# Altium project EnviroSense.PrjPcb (part 1 of 2)
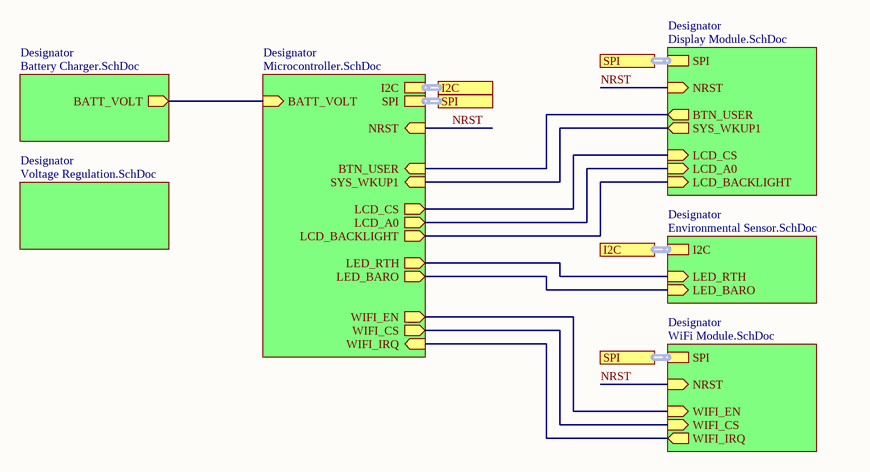
[diagram p0: EnviroSense.SchDoc]
7 sheets, 93 parts. Net scope: hierarchical (ports join the sheet entries above them; power ports are global).
Board file: EnviroSense.PcbDoc
Sheets:
  EnviroSense.SchDoc
    Designator = Microcontroller.SchDoc
    Designator = Battery Charger.SchDoc
    Designator = Voltage Regulation.SchDoc
    Designator = WiFi Module.SchDoc
    Designator = Environmental Sensor.SchDoc
    Designator = Display Module.SchDoc

## Sheet EnviroSense.SchDoc: EnviroSense Weather Monitor
size A4; SheetNumber: 1; SheetTotal: 7

### Sub-sheets
Designator = Microcontroller.SchDoc: LCD_CS (out), BATT_VOLT (in), NRST (in), LCD_A0 (out), WIFI_EN (out), LED_BARO (out), LCD_BACKLIGHT (out), WIFI_IRQ (in), SYS_WKUP1 (in), I2C (harness I2C), BTN_USER (in), WIFI_CS (out), SPI (harness SPI), LED_RTH (out)
Designator = Battery Charger.SchDoc: BATT_VOLT (out)
Designator = Voltage Regulation.SchDoc: no entries
Designator = WiFi Module.SchDoc: WIFI_EN (in), WIFI_IRQ (out), NRST (in), SPI (harness SPI), WIFI_CS (in)
Designator = Environmental Sensor.SchDoc: LED_BARO (in), I2C (harness I2C), LED_RTH (in)
Designator = Display Module.SchDoc: LCD_A0 (in), SPI (harness SPI), NRST (in), BTN_USER (out), SYS_WKUP1 (out), LCD_CS (in), LCD_BACKLIGHT (in)

### Ports
I2C (harness I2C), SPI (harness SPI)

### Nets
BATT_VOLT: sheet Designator/BATT_VOLT, sheet Designator/BATT_VOLT
BTN_USER: sheet Designator/BTN_USER, sheet Designator/BTN_USER
LCD_A0: sheet Designator/LCD_A0, sheet Designator/LCD_A0
LCD_BACKLIGHT: sheet Designator/LCD_BACKLIGHT, sheet Designator/LCD_BACKLIGHT
LCD_CS: sheet Designator/LCD_CS, sheet Designator/LCD_CS
LED_BARO: sheet Designator/LED_BARO, sheet Designator/LED_BARO
LED_RTH: sheet Designator/LED_RTH, sheet Designator/LED_RTH
NRST: sheet Designator/NRST, sheet Designator/NRST, sheet Designator/NRST
SYS_WKUP1: sheet Designator/SYS_WKUP1, sheet Designator/SYS_WKUP1
WIFI_CS: sheet Designator/WIFI_CS, sheet Designator/WIFI_CS
WIFI_EN: sheet Designator/WIFI_EN, sheet Designator/WIFI_EN
WIFI_IRQ: sheet Designator/WIFI_IRQ, sheet Designator/WIFI_IRQ

### Buses and harness runs
harness port I2C = sheet Designator/I2C
harness port SPI = sheet Designator/SPI

### Notes on the sheet
- Title
- Size:
- Date:
- A4
- Number:
- Time:
- Revision:
- Sheet
- of
- File:

## Sheet Microcontroller.SchDoc: Microcontroller
size A4; SheetNumber: 4; SheetTotal: 7
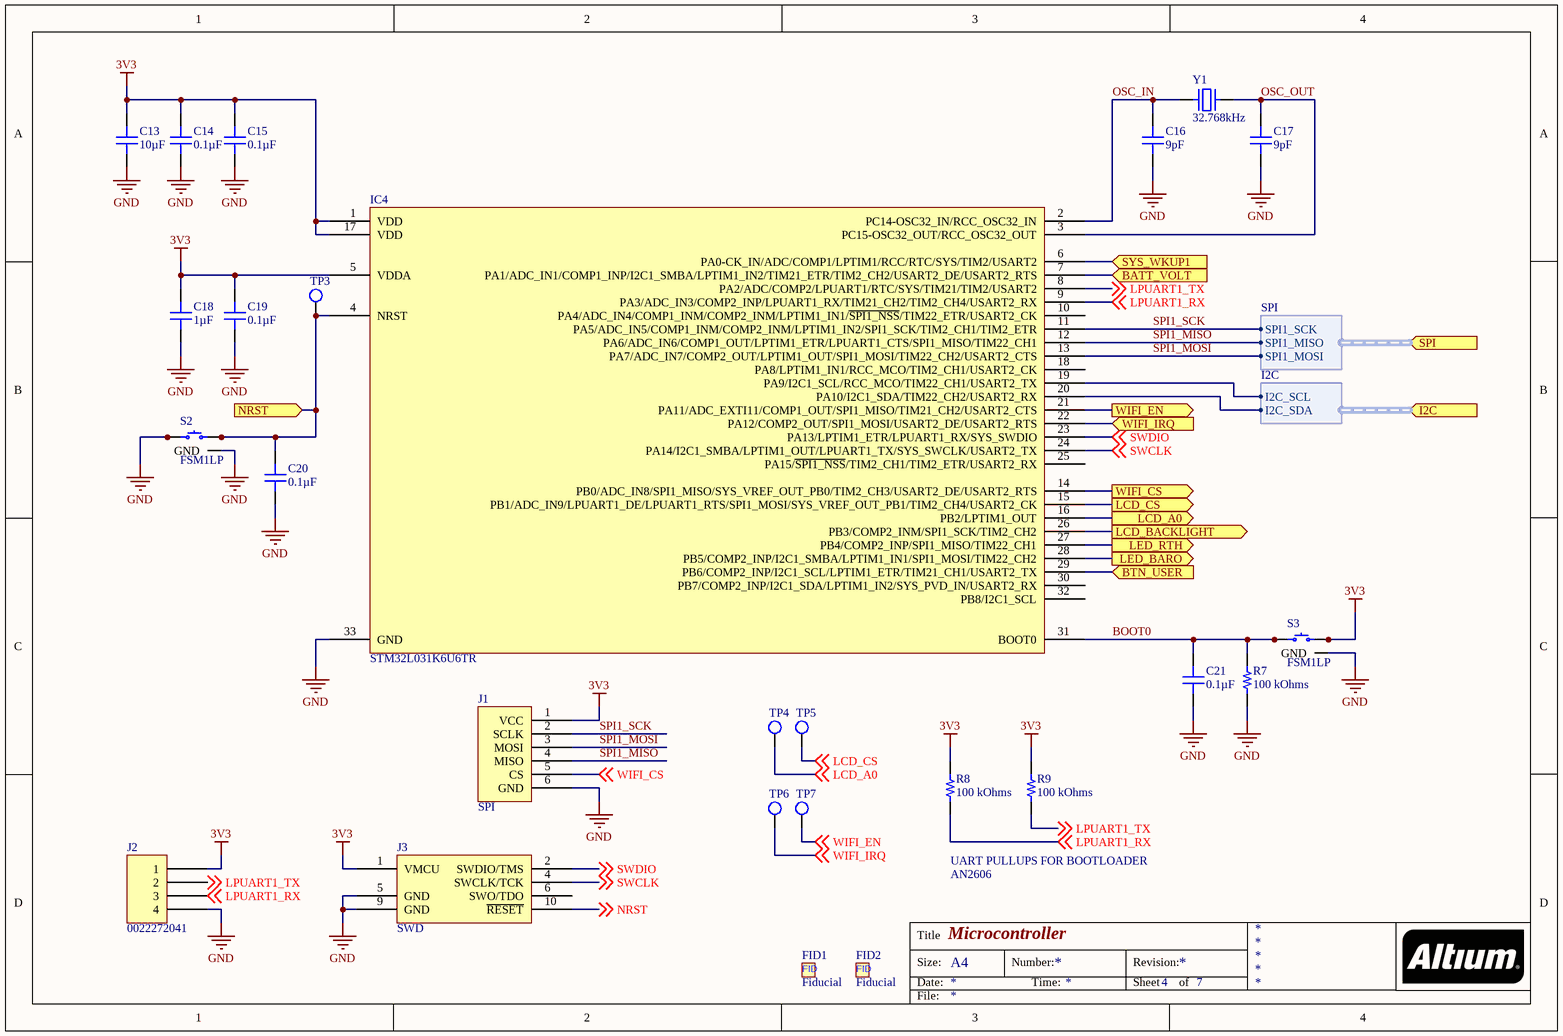
[diagram p1: Microcontroller.SchDoc]

### Parts
C13  10µF  [CAP 0805_2012]
C14  0.1µF  [CAP 0603_1608]
C15  0.1µF  [CAP 0603_1608]
C16  9pF  [CAP 0603_1608]
C17  9pF  [CAP 0603_1608]
C18  1µF  [CAP 0603_1608]
C19  0.1µF  [CAP 0603_1608]
C20  0.1µF  [CAP 0603_1608]
C21  0.1µF  [CAP 0603_1608]
FID1  Fiducial  [Fiducial-1mm]
FID2  Fiducial  [Fiducial-1mm]
IC4  STM32L031K6U6TR  [ST UFQFPN32 5x5MM]
J1  SPI  [SPI Breakout]
J2  0022272041  [MOLEX KK 0022272041]
J3  SWD  [10 Pin SWD]  (no BOM)
R7  100 kOhms  [RES 0603_1608]
R8  100 kOhms  [RES 0603_1608]
R9  100 kOhms  [RES 0603_1608]
S2  FSM1LP  [TE FSM1LPATR]
S3  FSM1LP  [TE FSM1LPATR]
TP3  Test Point  [TestPoint-1.5mm]  (value not drawn)  (no BOM)
TP4  Test Point  [TestPoint-1.5mm]  (value not drawn)  (no BOM)
TP5  Test Point  [TestPoint-1.5mm]  (value not drawn)  (no BOM)
TP6  Test Point  [TestPoint-1.5mm]  (value not drawn)  (no BOM)
TP7  Test Point  [TestPoint-1.5mm]  (value not drawn)  (no BOM)
Y1  32.768kHz  [ABRACON ABS07]

### Ports
BATT_VOLT (in), BTN_USER (in), I2C (in, harness I2C), LCD_A0 (out), LCD_BACKLIGHT (out), LCD_CS (out), LED_BARO (out), LED_RTH (out), NRST (in), SPI (in, harness SPI), SYS_WKUP1 (in), WIFI_CS (out), WIFI_EN (out), WIFI_IRQ (in)

### Harnesses
SPI: SPI1_MISO, SPI1_MOSI, SPI1_SCK
I2C: I2C_SDA, I2C_SCL

### Nets
3V3: C13.2 C14.2 C15.2 C18.2 C19.2 IC4.1(VDD) IC4.5(VDDA) IC4.17(VDD) J1.1(VCC) J2.1 J3.1(VMCU) R8.2 R9.2 S3.3 S3.4
GND: C13.1 C14.1 C15.1 C16.1 C17.1 C18.1 C19.1 C20.1 C21.1 IC4.33(GND) J1.6(GND) J2.4 J3.5(GND) J3.9(GND) R7.1 S2.1 S2.2 S2.5(GND) S3.5(GND)
BATT_VOLT: IC4.7(PA1/ADC_IN1/COMP1_INP/I2C1_SMBA/LPTIM1_IN2/TIM21_ETR/TIM2_CH2/USART2_DE/USART2_RTS) ; port BATT_VOLT
BOOT0: C21.2 IC4.31(BOOT0) R7.2 S3.1 S3.2
BTN_USER: IC4.29(PB6/COMP2_INP/I2C1_SCL/LPTIM1_ETR/TIM21_CH1/USART2_TX) ; port BTN_USER
I2C_SCL: IC4.19(PA9/I2C1_SCL/RCC_MCO/TIM22_CH1/USART2_TX) ; port I2C.I2C_SCL
I2C_SDA: IC4.20(PA10/I2C1_SDA/TIM22_CH2/USART2_RX) ; port I2C.I2C_SDA
LCD_A0: IC4.16(PB2/LPTIM1_OUT) ; port LCD_A0
LCD_A0: TP4.1(TP) ; off-sheet LCD_A0  [a separate net that carries the same name]
LCD_BACKLIGHT: IC4.26(PB3/COMP2_INM/SPI1_SCK/TIM2_CH2) ; port LCD_BACKLIGHT
LCD_CS: IC4.15(PB1/ADC_IN9/LPUART1_DE/LPUART1_RTS/SPI1_MOSI/SYS_VREF_OUT_PB1/TIM2_CH4/USART2_CK) ; port LCD_CS
LCD_CS: TP5.1(TP) ; off-sheet LCD_CS  [a separate net that carries the same name]
LED_BARO: IC4.28(PB5/COMP2_INP/I2C1_SMBA/LPTIM1_IN1/SPI1_MOSI/TIM22_CH2) ; port LED_BARO
LED_RTH: IC4.27(PB4/COMP2_INP/SPI1_MISO/TIM22_CH1) ; port LED_RTH
LPUART1_RX: IC4.9(PA3/ADC_IN3/COMP2_INP/LPUART1_RX/TIM21_CH2/TIM2_CH4/USART2_RX) J2.3 R8.1 ; off-sheet LPUART1_RX
LPUART1_TX: IC4.8(PA2/ADC/COMP2/LPUART1/RTC/SYS/TIM21/TIM2/USART2) J2.2 R9.1 ; off-sheet LPUART1_TX
NRST: C20.2 IC4.4(NRST) S2.3 S2.4 TP3.1(TP) ; port NRST
NRST: J3.10(~{RESET}) ; off-sheet NRST  [a separate net that carries the same name]
OSC_IN: C16.2 IC4.2(PC14-OSC32_IN/RCC_OSC32_IN) Y1.1
OSC_OUT: C17.2 IC4.3(PC15-OSC32_OUT/RCC_OSC32_OUT) Y1.2
SPI1_MISO: IC4.12(PA6/ADC_IN6/COMP1_OUT/LPTIM1_ETR/LPUART1_CTS/SPI1_MISO/TIM22_CH1) J1.4(MISO) ; port SPI.SPI1_MISO
SPI1_MOSI: IC4.13(PA7/ADC_IN7/COMP2_OUT/LPTIM1_OUT/SPI1_MOSI/TIM22_CH2/USART2_CTS) J1.3(MOSI) ; port SPI.SPI1_MOSI
SPI1_SCK: IC4.11(PA5/ADC_IN5/COMP1_INM/COMP2_INM/LPTIM1_IN2/SPI1_SCK/TIM2_CH1/TIM2_ETR) J1.2(SCLK) ; port SPI.SPI1_SCK
SWCLK: IC4.24(PA14/I2C1_SMBA/LPTIM1_OUT/LPUART1_TX/SYS_SWCLK/USART2_TX) J3.4(SWCLK/TCK) ; off-sheet SWCLK
SWDIO: IC4.23(PA13/LPTIM1_ETR/LPUART1_RX/SYS_SWDIO) J3.2(SWDIO/TMS) ; off-sheet SWDIO
SYS_WKUP1: IC4.6(PA0-CK_IN/ADC/COMP1/LPTIM1/RCC/RTC/SYS/TIM2/USART2) ; port SYS_WKUP1
WIFI_CS: IC4.14(PB0/ADC_IN8/SPI1_MISO/SYS_VREF_OUT_PB0/TIM2_CH3/USART2_DE/USART2_RTS) ; port WIFI_CS
WIFI_CS: J1.5(CS) ; off-sheet WIFI_CS  [a separate net that carries the same name]
WIFI_EN: IC4.21(PA11/ADC_EXTI11/COMP1_OUT/SPI1_MISO/TIM21_CH2/USART2_CTS) ; port WIFI_EN
WIFI_EN: TP7.1(TP) ; off-sheet WIFI_EN  [a separate net that carries the same name]
WIFI_IRQ: IC4.22(PA12/COMP2_OUT/SPI1_MOSI/USART2_DE/USART2_RTS) ; port WIFI_IRQ
WIFI_IRQ: TP6.1(TP) ; off-sheet WIFI_IRQ  [a separate net that carries the same name]

Not connected (* = marked no-connect by the designer): IC4 10(PA4/ADC_IN4/COMP1_INM/COMP2_INM/LPTIM1_IN1/~{SPI1_NSS}/TIM22_ETR/USART2_CK) 18(PA8/LPTIM1_IN1/RCC_MCO/TIM2_CH1/USART2_CK) 25(PA15/~{SPI1_NSS}/TIM2_CH1/TIM2_ETR/USART2_RX) 30(PB7/COMP2_INP/I2C1_SDA/LPTIM1_IN2/SYS_PVD_IN/USART2_RX) 32(PB8/I2C1_SCL); J3 6(SWO/TDO)

### Notes on the sheet
- UART PULLUPS FOR BOOTLOADER
- AN2606
- Title
- Size:
- Date:
- A4
- Number:
- Time:
- Revision:
- Sheet
- of
- File:
- (in symbol Fiducial) FID

### Library data of the parts
C13 = CL21A106KPCLQNC: CAP CER 10UF 10V X5R 0805; Manufacturer: Samsung Electro-Mechanics; Tolerance: ±10%; Part Number: CL21A106KPCLQNC; Value: 10µF; Applications: General Purpose; Capacitance: 10µF; ComponentLink1Description: Datasheet; ComponentLink1URL: http://www.samsungsem.com/kr/support/product-search/mlcc/CL21A106KPCLQNC.jsp; ComponentLink2Description: DigiKey Link; ComponentLink2URL: http://digikey.com/product-detail/en/samsung-electro-mechanics/CL21A106KPCLQNC/1276-2402-1-ND/3890488; Device Package: 0805 (2012 Metric); LastUpdated: 02/09/2020 01:04:19; Lifecycle Status: Active; Minimum Order: 1; Mounting Type: Surface Mount, MLCC; Operating Temperature: -55°C ~ 85°C; Package / Case: 0805 (2012 Metric); Packaging: TapeAndReel; PartId: 14319; Part Status: Active; Price: 0.03; Series: CL; Size / Dimension: 0.079" L x 0.049" W (2.00mm x 1.25mm); Supplier 1: DigiKey; Supplier Part Number 1: 1276-2402-1-ND; Temperature Coefficient: X5R; Thickness (Max): 0.037" (0.95mm); Voltage - Rated: 10V
C14 C15 C19-C21 = 06035C104JAT4A: CAP CER 0.1UF 50V X7R 0603; Manufacturer: AVX Corporation; Tolerance: ±5%; Part Number: 06035C104JAT4A; Value: 0.1µF; Applications: General Purpose; Capacitance: 0.1µF; ComponentLink1Description: Datasheet; ComponentLink1URL: http://datasheets.avx.com/X7RDielectric.pdf; ComponentLink2Description: DigiKey Link; ComponentLink2URL: http://digikey.com/product-detail/en/avx-corporation/06035C104JAT4A/478-12459-1-ND/9749311; Device Package: 0603 (1608 Metric); LastUpdated: 02/09/2020 01:03:34; Lifecycle Status: Active; Minimum Order: 1; Mounting Type: Surface Mount, MLCC; Operating Temperature: -55°C ~ 125°C; Package / Case: 0603 (1608 Metric); Packaging: TapeAndReel; PartId: 3002; Part Status: Active; Price: 0.01; Series: -; Size / Dimension: 0.063" L x 0.032" W (1.60mm x 0.81mm); Supplier 1: DigiKey; Supplier Part Number 1: 478-12459-1-ND; Temperature Coefficient: X7R; Thickness (Max): 0.035" (0.90mm); Voltage - Rated: 50V
C16 C17 = CL10C090CB8NNNC: CAP CER 9PF 50V C0G/NP0 0603; Manufacturer: Samsung Electro-Mechanics; Temperature Coefficient: C0G, NP0; Tolerance: ±0.25pF; Part Number: CL10C090CB8NNNC; Value: 9pF; Applications: General Purpose; Capacitance: 9pF; ComponentLink1Description: Datasheet; ComponentLink1URL: http://www.samsungsem.com/kr/support/product-search/mlcc/CL10C090CB8NNNC.jsp; ComponentLink2Description: DigiKey Link; ComponentLink2URL: http://digikey.com/product-detail/en/samsung-electro-mechanics/CL10C090CB8NNNC/1276-2142-1-ND/3890228; Device Package: 0603 (1608 Metric); LastUpdated: 02/09/2020 01:03:13; Lifecycle Status: Active; Minimum Order: 1; Mounting Type: Surface Mount, MLCC; Operating Temperature: -55°C ~ 125°C; Package / Case: 0603 (1608 Metric); Packaging: TapeAndReel; PartId: 14182; Part Status: Active; Price: 0.01; Series: CL; Size / Dimension: 0.063" L x 0.031" W (1.60mm x 0.80mm); Supplier 1: DigiKey; Supplier Part Number 1: 1276-2142-1-ND; Thickness (Max): 0.035" (0.90mm); Voltage - Rated: 50V
C18 = LMK107B7105KA-T: CAP CER 1UF 10V X7R 0603; Manufacturer: Taiyo Yuden; Tolerance: ±10%; Part Number: LMK107B7105KA-T; Value: 1µF; Applications: General Purpose; Capacitance: 1µF; ComponentLink1Description: Datasheet; ComponentLink1URL: https://www.yuden.co.jp/productdata/catalog/mlcc01_e.pdf; ComponentLink2Description: DigiKey Link; ComponentLink2URL: http://digikey.com/product-detail/en/taiyo-yuden/LMK107B7105KA-T/587-1242-1-ND/931019; Device Package: 0603 (1608 Metric); LastUpdated: 02/09/2020 01:03:30; Lifecycle Status: Active; Minimum Order: 1; Mounting Type: Surface Mount, MLCC; Operating Temperature: -55°C ~ 125°C; Package / Case: 0603 (1608 Metric); Packaging: TapeAndReel; PartId: 5525; Part Status: Active; Price: 0.01; Series: M; Size / Dimension: 0.063" L x 0.031" W (1.60mm x 0.80mm); Supplier 1: DigiKey; Supplier Part Number 1: 587-1242-1-ND; Temperature Coefficient: X7R; Thickness (Max): 0.035" (0.90mm); Voltage - Rated: 10V
IC4 = STM32L031K6U6TR: IC MCU 32BIT 32KB FLASH 32UFQFPN; Manufacturer: STMicroelectronics; Connectivity: I²C, IrDA, LINbus, SPI, UART/USART; Core Processor: ARM® Cortex®-M0+; Core Size: 32-Bit; Data Converters: A/D 10x12b; EEPROM Size: 1K x 8; Number of I/O: 27; Oscillator Type: Internal; Peripherals: Brown-out Detect/Reset, DMA, POR, PWM, WDT; Program Memory Size: 32KB (32K x 8); RAM Size: 8K x 8; Speed: 32MHz; Voltage - Supply (Vcc/Vdd): 1.8V ~ 3.6V; Part Number: STM32L031K6U6TR; ComponentLink1Description: Datasheet; ComponentLink1URL: http://www.st.com/content/ccc/resource/technical/document/datasheet/aa/5d/77/ad/1a/59/4a/b9/DM00140359.pdf/files/DM00140359.pdf/jcr:content/translations/en.DM00140359.pdf; ComponentLink2Description: DigiKey Link; ComponentLink2URL: http://digikey.com/product-detail/en/stmicroelectronics/STM32L031K6U6TR/497-18807-1-ND/9958467; LastUpdated: 18/01/2022 11:56:57; Lifecycle Status: Active; Minimum Order: 1; Mounting Type: Surface Mount; Operating Temperature: -40°C ~ 85°C (TA); Package / Case: 32-UFQFN Exposed Pad; Packaging: TapeAndReel; PartId: 225; Part Status: Active; Price: 1.15; Program Memory Type: FLASH; Series: STM32L0; Supplier 1: DigiKey; Supplier Part Number 1: 497-18807-1-ND; Supplier Device Package: 32-UFQFPN (5x5)
J2 = 0022272041: CONN HEADER VERT 4POS 2.54MM; Manufacturer: Molex; Contact Length - Mating: 0.295" (7.49mm); Contact Length - Post: 0.140" (3.56mm); Material Flammability Rating: UL94 V-0; Number of Positions: 4; Number of Positions Loaded: All; Overall Contact Length: 0.560" (14.22mm); Pitch - Mating: 0.100" (2.54mm); Shrouding: Shrouded - 1 Wall; Style: Board to Cable/Wire; Part Number: 0022272041; ComponentLink1Description: Datasheet; ComponentLink1URL: https://www.molex.com/pdm_docs/sd/022272041_sd.pdf; ComponentLink2Description: DigiKey Link; ComponentLink2URL: http://digikey.com/product-detail/en/molex/0022272041/WM4113-ND/1130579; Connector Type: Header; Contact Finish - Mating: Tin; Contact Finish - Post: Tin; Contact Finish Thickness - Mating: 100.0µin (2.54µm); Contact Material: Brass; Contact Shape: Square; Contact Type: Male Pin; Fastening Type: Friction Lock; Insulation Color: Natural; Insulation Height: 0.461" (11.70mm); Insulation Material: Polyamide (PA), Nylon; LastUpdated: 12/01/2020 23:52:05; Lifecycle Status: Active; Minimum Order: 1; Mounting Type: Through Hole; Number of Rows: 1; Packaging: Bulk; PartId: 78; Part Status: Active; Price: 0.40; Series: KK 6410; Supplier 1: DigiKey; Supplier Part Number 1: WM4113-ND; Termination: Solder
R7-R9 = ERJ-PA3J104V: RES SMD 100K OHM 5% 1/4W 0603; Manufacturer: Panasonic Electronic Components; Power (Watts): 0.25W, 1/4W; Temperature Coefficient: ±200ppm/°C; Part Number: ERJ-PA3J104V; Value: 100 kOhms; ComponentLink1Description: Datasheet; ComponentLink1URL: https://industrial.panasonic.com/cdbs/www-data/pdf/RDO0000/AOA0000C331.pdf; ComponentLink2Description: DigiKey Link; ComponentLink2URL: http://digikey.com/product-detail/en/panasonic-electronic-components/ERJ-PA3J104V/P100KBZCT-ND/5036238; Composition: Thick Film; Device Package: 0603 (1608 Metric); Features: Automotive AEC-Q200, Pulse Withstanding; Height - Seated (Max): 0.022" (0.55mm); LastUpdated: 02/09/2020 01:10:15; Lifecycle Status: Active; Minimum Order: 1; Number of Terminations: 2; Operating Temperature: -55°C ~ 155°C; Package / Case: 0603 (1608 Metric); Packaging: TapeAndReel; PartId: 9671; Part Status: Active; Price: 0.01; Ratings: AEC-Q200; Resistance: 100 kOhms; Series: ERJ; Size / Dimension: 0.063" L x 0.031" W (1.60mm x 0.80mm); Supplier 1: DigiKey; Supplier Part Number 1: P100KBZCT-ND; Supplier Device Package: 0603; Tolerance: ±5%
S2 S3 = FSM1LP: SWITCH TACTILE SPST-NO 0.05A 24V; Manufacturer: TE Connectivity ALCOSWITCH Switches; Actuator Height off PCB, Vertical: 3.10mm; Actuator Orientation: Top Actuated; Actuator Type: Standard; Contact Rating @ Voltage: 0.05A @ 24VDC; Illumination: Non-Illuminated; Operating Force: 160gf; Outline: 6.00mm x 6.00mm; Switch Function: Off-Mom; Part Number: FSM1LP; Circuit: SPST-NO; ComponentLink1Description: Datasheet; ComponentLink1URL: https://www.te.com/commerce/DocumentDelivery/DDEController?Action=srchrtrv&DocNm=1-1437565-8&DocType=Customer+Drawing&DocLang=English; ComponentLink2Description: DigiKey Link; ComponentLink2URL: http://digikey.com/product-detail/en/te-connectivity-alcoswitch-switches/FSM1LP/450-1132-ND/525816; Features: Grounding Pin; LastUpdated: 04/02/2020 14:40:32; Lifecycle Status: Active; Minimum Order: 1; Mounting Type: Surface Mount; Operating Temperature: -35°C ~ 85°C; Packaging: Bulk; Part Status: Active; Price: 0.51; Series: FSM1LP; Supplier 1: DigiKey; Supplier Part Number 1: 450-1132-ND; Termination Style: Gull Wing
Y1 = ABS07-166-32.768KHZ-T: IOT 32.786KHZ XTAL; Manufacturer: Abracon LLC; ESR (Equivalent Series Resistance): 70 kOhms; Frequency Tolerance: ±10ppm; Load Capacitance: 7pF; Operating Mode: Fundamental; Part Number: ABS07-166-32.768KHZ-T; ComponentLink1Description: Datasheet; ComponentLink1URL: https://abracon.com/datasheets/ABS07-166-32.768kHz-T.pdf; ComponentLink2Description: DigiKey Link; ComponentLink2URL: http://digikey.com/product-detail/en/abracon-llc/ABS07-166-32.768KHZ-T/535-14514-1-ND/8827205; Frequency: 32.768kHz; Height - Seated (Max): 0.035" (0.90mm); LastUpdated: 02/09/2020 01:21:47; Lifecycle Status: Active; Minimum Order: 1; Mounting Type: Surface Mount; Operating Temperature: -40°C ~ 85°C; Package / Case: 2-SMD, No Lead; Packaging: TapeAndReel; PartId: 384; Part Status: Active; Price: 0.35; Series: ABS07; Size / Dimension: 0.126" L x 0.059" W (3.20mm x 1.50mm); Supplier 1: DigiKey; Supplier Part Number 1: 535-14514-1-ND; Type: kHz Crystal (Tuning Fork); Value: 32.768kHz

## Sheet Battery Charger.SchDoc
size A4; SheetNumber: 6; SheetTotal: 7
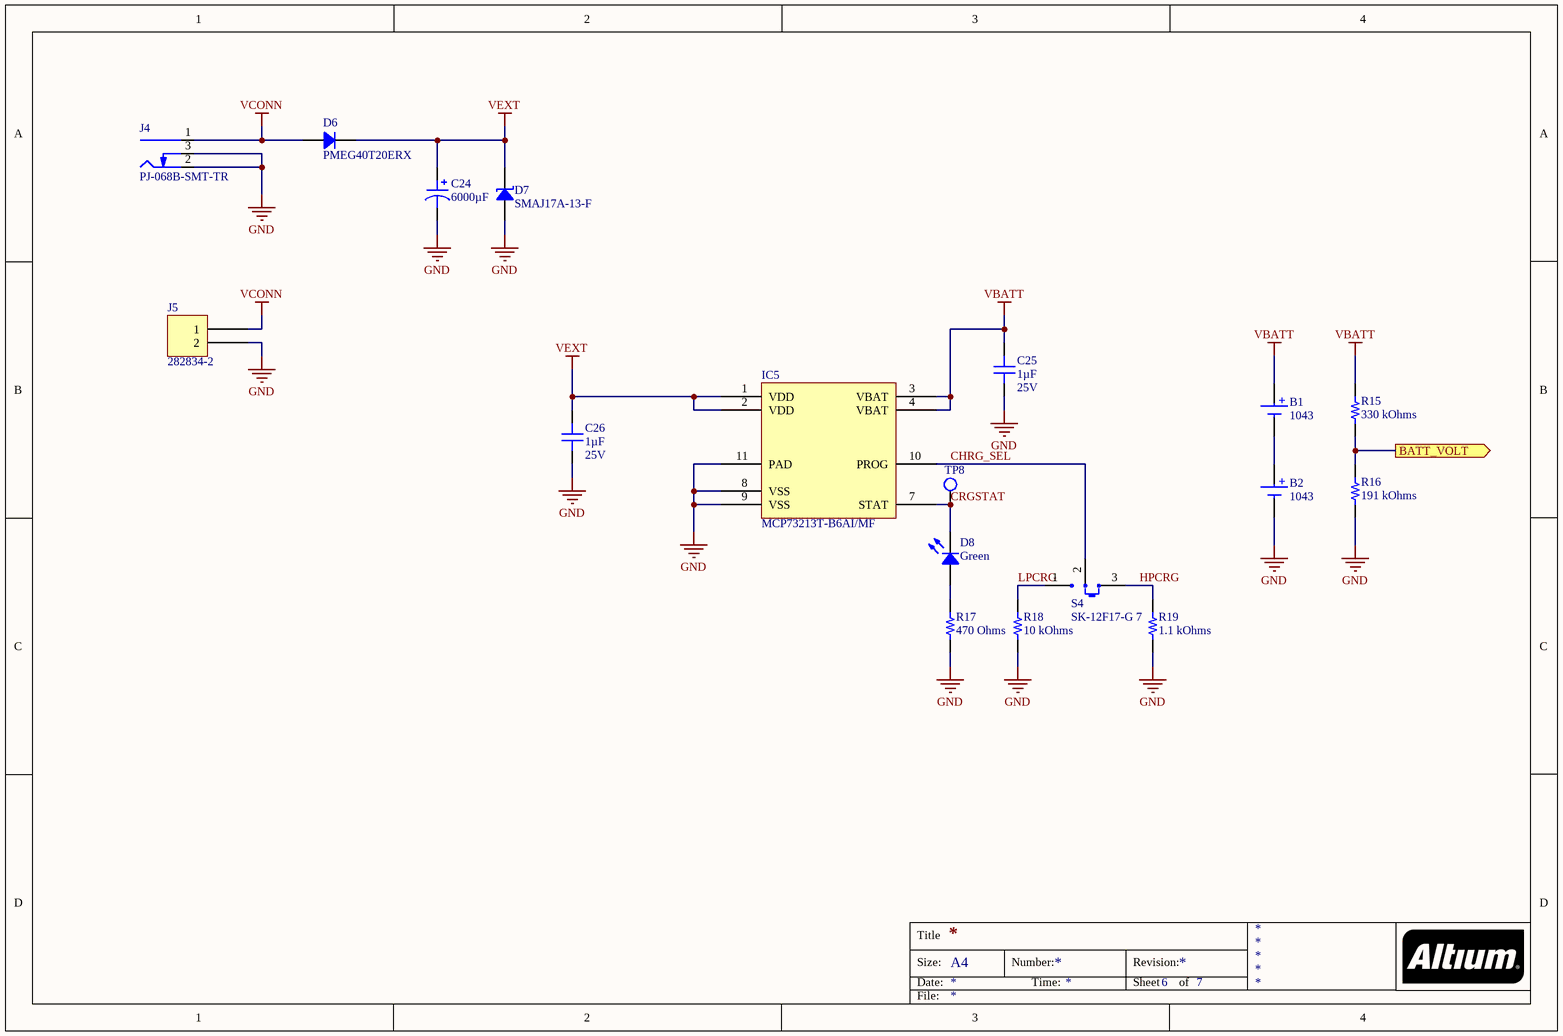
[diagram p2: Battery Charger.SchDoc]

### Parts
B1  1043  [KEYSTONE 1043]
B2  1043  [KEYSTONE 1043]
C24  6000µF  [CAP TH ALUM ELEC D18.00mm S7.50mm H33.00mm]
C25  Voltage - Rated: 25V  [CAP 0603_1608]  (hidden comment: 1µF)
C26  Voltage - Rated: 25V  [CAP 0603_1608]  (hidden comment: 1µF)
D6  PMEG40T20ERX  [SOD-123W]
D7  SMAJ17A-13-F  [DO214AC SMA]
D8  Green  [LED 1206_3216 GREEN]
IC5  MCP73213T-B6AI/MF  [MICROCHIP DFN-10 3MMX3MM MF]
J4  PJ-068B-SMT-TR  [CUI PJ-068B-SMT]
J5  282834-2  [TE 282834-2]
R15  330 kOhms  [RES 0603_1608]
R16  191 kOhms  [RES 0603_1608]
R17  470 Ohms  [RES 0603_1608]
R18  10 kOhms  [RES 0603_1608]
R19  1.1 kOhms  [RES 0603_1608]
S4  SK-12F17-G 7  [C&K SK-12F17-G 7]
TP8  Test Point  [TestPoint-1.5mm]  (value not drawn)  (no BOM)

### Ports
BATT_VOLT (out)

### Nets
GND: B2.2(-) C24.2 C25.2 C26.2 D7.1 IC5.8(VSS) IC5.9(VSS) IC5.11(PAD) J4.2(Outer) J4.3(SW) J5.2 R16.1 R17.1 R18.1 R19.1
VBATT: B1.1(+) C25.1 IC5.3(VBAT) IC5.4(VBAT) R15.2
VCONN: D6.1 J4.1(Centre) J5.1
VEXT: C24.1 C26.1 D6.2 D7.2 IC5.1(VDD) IC5.2(VDD)
BATT_VOLT: R15.1 R16.2 ; port BATT_VOLT
CHRG_SEL: IC5.10(PROG) S4.2(COM)
CRGSTAT: D8.2 IC5.7(STAT) TP8.1(TP)
HPCRG: R19.2 S4.3
LPCRG: R18.2 S4.1
NetB1_2: B1.2(-) B2.1(+)
NetD8_1: D8.1 R17.2

### Notes on the sheet
- Title
- Size:
- Date:
- A4
- Number:
- Time:
- Revision:
- Sheet
- of
- File:

### Library data of the parts
B1 B2 = 1043: BATTERY HOLDER 18650 PC PIN; Manufacturer: Keystone Electronics; Battery Cell Size: 18650; Battery Type, Function: Cylindrical, Holder; Number of Cells: 1; Style: Holder (Open); Part Number: 1043; ComponentLink1Description: Datasheet; ComponentLink1URL: http://keyelco.com/userAssets/file/M65p27.pdf; ComponentLink2Description: DigiKey Link; ComponentLink2URL: http://digikey.com/product-detail/en/keystone-electronics/1043/36-1043-ND/2745669; Height Above Board: 0.585" (14.86mm); LastUpdated: 02/02/2020 09:19:56; Lifecycle Status: Active; Minimum Order: 1; Mounting Type: PCB, Through Hole; Operating Temperature: -50°C ~ 145°C; Packaging: Unknown; PartId: 2; Part Status: Active; Price: 2.58; Series: -; Supplier 1: DigiKey; Supplier Part Number 1: 36-1043-ND; Termination Style: PC Pin
C24 = ELBK350ELL602AMN3S: CAP ALUM 6000UF 35V T/H; Manufacturer: United Chemi-Con; ESR (Equivalent Series Resistance): 19mOhm @ 100kHz; Lifetime @ Temp.: 5000 Hrs @ 105°C; Polarization: Polar; Ripple Current @ High Frequency: 3.5A @ 100kHz; Ripple Current @ Low Frequency: 2.975A @ 120Hz; Part Number: ELBK350ELL602AMN3S; Applications: Automotive; Capacitance: 6000µF; ComponentLink1Description: Datasheet; ComponentLink1URL: //media.digikey.com/pdf/Data%20Sheets/United%20Chemi-Con%20PDFs/LBK_Series.pdf; ComponentLink2Description: DigiKey Link; ComponentLink2URL: http://digikey.com/product-detail/en/united-chemi-con/ELBK350ELL602AMN3S/565-4353-ND/5824556; Device Package: Radial, Can; Height - Seated (Max): 1.299" (33.00mm); LastUpdated: 02/09/2020 01:33:24; Lead Spacing: 0.295" (7.50mm); Lifecycle Status: Active; Minimum Order: 1; Mounting Type: Through Hole; Operating Temperature: -55°C ~ 105°C; Package / Case: Radial, Can; Packaging: Bulk; PartId: 18495; Part Status: Active; Price: 3.93; Ratings: AEC-Q200; Series: LBK; Size / Dimension: 0.709" Dia (18.00mm); Supplier 1: DigiKey; Supplier Part Number 1: 565-4353-ND; Value: 6000µF; Voltage - Rated: 35V
C25 C26 = CL10A105KA8NNNC: CAP CER 1UF 25V X5R 0603; Manufacturer: Samsung Electro-Mechanics; Tolerance: ±10%; Part Number: CL10A105KA8NNNC; Value: 1µF; Applications: General Purpose; Capacitance: 1µF; ComponentLink1Description: Datasheet; ComponentLink1URL: http://www.samsungsem.com/kr/support/product-search/mlcc/CL10A105KA8NNNC.jsp; ComponentLink2Description: DigiKey Link; ComponentLink2URL: http://digikey.com/product-detail/en/samsung-electro-mechanics/CL10A105KA8NNNC/1276-1102-1-ND/3889188; Device Package: 0603 (1608 Metric); LastUpdated: 02/09/2020 01:03:30; Lifecycle Status: Active; Minimum Order: 1; Mounting Type: Surface Mount, MLCC; Operating Temperature: -55°C ~ 85°C; Package / Case: 0603 (1608 Metric); Packaging: TapeAndReel; PartId: 5508; Part Status: Active; Price: 0.01; Series: CL; Size / Dimension: 0.063" L x 0.031" W (1.60mm x 0.80mm); Supplier 1: DigiKey; Supplier Part Number 1: 1276-1102-1-ND; Temperature Coefficient: X5R; Thickness (Max): 0.035" (0.90mm)
D6 = PMEG40T20ERX: DIODE SCHOTTKY 40V 2A SOD123W; Manufacturer: Nexperia USA Inc.; Capacitance @ Vr, F: 350pF @ 1V, 1MHz; Current - Reverse Leakage @ Vr: 22µA @ 40V; Reverse Recovery Time (trr): 11.5ns; Speed: Fast Recovery =< 500ns, > 200mA (Io); Voltage - Forward (Vf) (Max) @ If: 450mV @ 2A; Part Number: PMEG40T20ERX; ComponentLink1Description: Datasheet; ComponentLink1URL: https://assets.nexperia.com/documents/data-sheet/PMEG40T20ER.pdf; ComponentLink2Description: DigiKey Link; ComponentLink2URL: http://digikey.com/product-detail/en/nexperia-usa-inc/PMEG40T20ERX/1727-7479-1-ND/7897325; Current - Average Rectified (Io): 2A; Diode Type: Schottky; LastUpdated: 02/09/2020 01:30:31; Lifecycle Status: Active; Minimum Order: 1; Mounting Type: Surface Mount; Operating Temperature - Junction: 175°C (Max); Package / Case: SOD-123W; Packaging: TapeAndReel; PartId: 3169; Part Status: Active; Price: 0.12; Series: Automotive, AEC-Q101; Supplier 1: DigiKey; Supplier Part Number 1: 1727-7479-1-ND; Supplier Device Package: SOD-123W; Voltage - DC Reverse (Vr) (Max): 40V
D7 = SMAJ17A-13-F: TVS DIODE 17V 27.6V SMA; Manufacturer: Diodes Incorporated; Current - Peak Pulse (10/1000µs): 14.5A; Power Line Protection: No; Power - Peak Pulse: 400W; Type: Zener; Unidirectional Channels: 1; Voltage - Breakdown (Min): 18.9V; Part Number: SMAJ17A-13-F; Applications: General Purpose; ComponentLink1Description: Datasheet; ComponentLink1URL: https://www.diodes.com/assets/Datasheets/ds19005.pdf; ComponentLink2Description: DigiKey Link; ComponentLink2URL: http://digikey.com/product-detail/en/diodes-incorporated/SMAJ17A-13-F/SMAJ17A-FDICT-ND/806582; LastUpdated: 02/09/2020 01:20:16; Lifecycle Status: Active; Minimum Order: 1; Mounting Type: Surface Mount; Operating Temperature: -55°C ~ 150°C (TJ); Package / Case: DO-214AC, SMA; Packaging: TapeAndReel; PartId: 5955; Part Status: Active; Price: 0.08; Series: -; Supplier 1: DigiKey; Supplier Part Number 1: SMAJ17A-FDICT-ND; Supplier Device Package: SMA; Voltage - Clamping (Max) @ Ipp: 27.6V; Voltage - Reverse Standoff (Typ): 17V
D8 = QTLP650C4TR: LED GREEN CLEAR 1206 SMD; Manufacturer: Everlight Electronics Co Ltd; Configuration: Standard; Current - Test: 20mA; Lens Color: Colorless; Lens Size: 2.00mm x 1.60mm; Lens Style: Rectangle with Flat Top; Millicandela Rating: 10mcd; Viewing Angle: 140°; Voltage - Forward (Vf) (Typ): 2.1V; Wavelength - Dominant: 570nm; Wavelength - Peak: 565nm; Part Number: QTLP650C4TR; Color: Green; ComponentLink1Description: Datasheet; ComponentLink1URL: //media.digikey.com/pdf/Data%20Sheets/Everlight%20PDFs/QTLP650(C,D)-2,3,4,7,B.pdf; ComponentLink2Description: DigiKey Link; ComponentLink2URL: http://digikey.com/product-detail/en/everlight-electronics-co-ltd/QTLP650C4TR/1080-1415-1-ND/2676149; Device Package: 1206 (3216 Metric); Height (Max): 1.30mm; LastUpdated: 02/09/2020 01:20:47; Lens Transparency: Clear; Lifecycle Status: Active; Minimum Order: 1; Mounting Type: Surface Mount; Package / Case: 1206 (3216 Metric); Packaging: TapeAndReel; PartId: 563; Part Status: Active; Price: 0.06; Series: -; Size / Dimension: 3.20mm L x 1.60mm W; Supplier 1: DigiKey; Supplier Part Number 1: 1080-1415-1-ND; Supplier Device Package: 1206; Value: Green
IC5 = MCP73213T-B6AI/MF: DUAL CELL OVP BATTERY CHARGER; Manufacturer: Microchip Technology; Battery Chemistry: Lithium Ion/Polymer; Battery Pack Voltage: 8.2V; Charge Current - Max: 1.1A; Current - Charging: Constant - Programmable; Fault Protection: Over Voltage; Number of Cells: 2; Voltage - Supply (Max): 13V; Part Number: MCP73213T-B6AI/MF; ComponentLink1Description: Datasheet; ComponentLink1URL: http://www.microchip.com/mymicrochip/filehandler.aspx?ddocname=en544011; ComponentLink2Description: DigiKey Link; ComponentLink2URL: http://digikey.com/product-detail/en/microchip-technology/MCP73213T-B6AI-MF/MCP73213T-B6AI-MFCT-ND/7898471; LastUpdated: 18/01/2022 15:56:16; Lifecycle Status: Active; Minimum Order: 1; Mounting Type: Surface Mount; Operating Temperature: -40°C ~ 85°C (TA); Package / Case: 10-VFDFN Exposed Pad; Packaging: TapeAndReel; PartId: 43; Part Status: Active; Price: 1.35; Series: -; Supplier 1: DigiKey; Supplier Part Number 1: MCP73213T-B6AI/MFCT-ND; Supplier Device Package: 10-DFN (3x3)
J4 = PJ-068B-SMT-TR: CONN PWR JACK 2.5X5.5MM SOLDER; Manufacturer: CUI Devices; Actual Diameter: 0.098" (2.50mm ID), 0.232" (5.90mm OD); Current Rating (Amps): 5A; Gender: Male; Industry Recognized Mating Diameter: 2.50mm ID (0.098"), 5.50mm OD (0.217"); Internal Switch(s): Single Switch, Normally Closed; Material Flammability Rating: UL94 V-0; Mating Length/Depth: 0.323" (8.20mm); Number of Positions/Contacts: 2 Conductors, 3 Contacts; Shielding: Shielded; Voltage - Rated: 24VDC; Part Number: PJ-068B-SMT-TR; ComponentLink1Description: Datasheet; ComponentLink1URL: https://www.cuidevices.com/product/resource/digikeypdf/pj-068b-smt-tr.pdf; ComponentLink2Description: DigiKey Link; ComponentLink2URL: //digikey.com/product-detail/en/cui-devices/PJ-068B-SMT-TR/CP-068BPJTR-ND/2625163; Connector Type: Jack; Features: Board Guide; LastUpdated: 16/12/2019 18:57:10; Lifecycle Status: 0; Minimum Order: 1; Mounting Type: Surface Mount, Right Angle; Packaging: TapeAndReel; Part Status: Active; Price: 1.38; Series: -; Supplier 1: DigiKey; Supplier Part Number 1: CP-068BPJTR-ND; Termination: Solder
J5 = 282834-2: TERM BLK 2P SIDE ENT 2.54MM PCB; Manufacturer: TE Connectivity AMP Connectors; Current: 10A; Mating Orientation: Horizontal with Board; Number of Levels: 1; Pitch: 0.100" (2.54mm); Positions Per Level: 2; Voltage: 150V; Wire Gauge: 16-30 AWG; Wire Termination: Screw - Rising Cage Clamp; Part Number: 282834-2; Color: Green; ComponentLink1Description: Datasheet; ComponentLink1URL: https://www.te.com/commerce/DocumentDelivery/DDEController?Action=srchrtrv&DocNm=282834&DocType=Customer+Drawing&DocLang=English; ComponentLink2Description: DigiKey Link; ComponentLink2URL: http://digikey.com/product-detail/en/te-connectivity-amp-connectors/282834-2/A98333-ND/1150135; LastUpdated: 15/01/2020 04:15:38; Lifecycle Status: Active; Minimum Order: 1; Mounting Type: Through Hole; Packaging: Bulk; Part Status: Active; Price: 0.88; Series: Buchanan; Supplier 1: DigiKey; Supplier Part Number 1: A98333-ND
R15 = ERJ-PA3J334V: RES SMD 330K OHM 5% 1/4W 0603; Manufacturer: Panasonic Electronic Components; Power (Watts): 0.25W, 1/4W; Temperature Coefficient: ±200ppm/°C; Part Number: ERJ-PA3J334V; Value: 330 kOhms; ComponentLink1Description: Datasheet; ComponentLink1URL: https://industrial.panasonic.com/cdbs/www-data/pdf/RDO0000/AOA0000C331.pdf; ComponentLink2Description: DigiKey Link; ComponentLink2URL: http://digikey.com/product-detail/en/panasonic-electronic-components/ERJ-PA3J334V/P330KBZCT-ND/5036310; Composition: Thick Film; Device Package: 0603 (1608 Metric); Features: Automotive AEC-Q200, Pulse Withstanding; Height - Seated (Max): 0.022" (0.55mm); LastUpdated: 02/09/2020 01:10:16; Lifecycle Status: Active; Minimum Order: 1; Number of Terminations: 2; Operating Temperature: -55°C ~ 155°C; Package / Case: 0603 (1608 Metric); Packaging: TapeAndReel; PartId: 8919; Part Status: Active; Price: 0.01; Ratings: AEC-Q200; Resistance: 330 kOhms; Series: ERJ; Size / Dimension: 0.063" L x 0.031" W (1.60mm x 0.80mm); Supplier 1: DigiKey; Supplier Part Number 1: P330KBZCT-ND; Supplier Device Package: 0603; Tolerance: ±5%
R16 = ERJ-3EKF1913V: RES SMD 191K OHM 1% 1/10W 0603; Manufacturer: Panasonic Electronic Components; Power (Watts): 0.1W, 1/10W; Temperature Coefficient: ±100ppm/°C; Part Number: ERJ-3EKF1913V; Value: 191 kOhms; ComponentLink1Description: Datasheet; ComponentLink1URL: https://industrial.panasonic.com/cdbs/www-data/pdf/RDA0000/AOA0000C304.pdf; ComponentLink2Description: DigiKey Link; ComponentLink2URL: http://digikey.com/product-detail/en/panasonic-electronic-components/ERJ-3EKF1913V/P191KHCT-ND/198216; Composition: Thick Film; Device Package: 0603 (1608 Metric); Features: Automotive AEC-Q200; Height - Seated (Max): 0.022" (0.55mm); LastUpdated: 02/09/2020 01:09:38; Lifecycle Status: Active; Minimum Order: 1; Number of Terminations: 2; Operating Temperature: -55°C ~ 155°C; Package / Case: 0603 (1608 Metric); Packaging: TapeAndReel; PartId: 24201; Part Status: Active; Price: 0.01; Ratings: AEC-Q200; Resistance: 191 kOhms; Series: ERJ; Size / Dimension: 0.063" L x 0.031" W (1.60mm x 0.80mm); Supplier 1: DigiKey; Supplier Part Number 1: P191KHCT-ND; Supplier Device Package: 0603; Tolerance: ±1%
R17 = CRGCQ0603J470R: CRGCQ 0603 470R 5%; Manufacturer: TE Connectivity Passive Product; Power (Watts): 0.1W, 1/10W; Temperature Coefficient: ±100ppm/°C; Part Number: CRGCQ0603J470R; Value: 470 Ohms; ComponentLink1Description: Datasheet; ComponentLink1URL: https://www.te.com/commerce/DocumentDelivery/DDEController?Action=srchrtrv&DocNm=1773204-3&DocType=DS&DocLang=English; ComponentLink2Description: DigiKey Link; ComponentLink2URL: http://digikey.com/product-detail/en/te-connectivity-passive-product/CRGCQ0603J470R/A130089CT-ND/8577921; Composition: Thick Film; Device Package: 0603 (1608 Metric); Features: Automotive AEC-Q200, Moisture Resistant; Height - Seated (Max): 0.022" (0.55mm); LastUpdated: 02/09/2020 01:09:31; Lifecycle Status: Active; Minimum Order: 1; Number of Terminations: 2; Operating Temperature: -55°C ~ 155°C; Package / Case: 0603 (1608 Metric); Packaging: CutTape; PartId: 25681; Part Status: Active; Price: 0.10; Ratings: AEC-Q200; Resistance: 470 Ohms; Series: CRGCQ; Size / Dimension: 0.063" L x 0.031" W (1.60mm x 0.80mm); Supplier 1: DigiKey; Supplier Part Number 1: A130089CT-ND; Supplier Device Package: 0603; Tolerance: ±5%
R18 = ERJ-PA3J103V: RES SMD 10K OHM 5% 1/4W 0603; Manufacturer: Panasonic Electronic Components; Power (Watts): 0.25W, 1/4W; Temperature Coefficient: ±200ppm/°C; Part Number: ERJ-PA3J103V; Value: 10 kOhms; ComponentLink1Description: Datasheet; ComponentLink1URL: https://industrial.panasonic.com/cdbs/www-data/pdf/RDO0000/AOA0000C331.pdf; ComponentLink2Description: DigiKey Link; ComponentLink2URL: http://digikey.com/product-detail/en/panasonic-electronic-components/ERJ-PA3J103V/P10KBZCT-ND/5036237; Composition: Thick Film; Device Package: 0603 (1608 Metric); Features: Automotive AEC-Q200, Pulse Withstanding; Height - Seated (Max): 0.022" (0.55mm); LastUpdated: 02/09/2020 01:10:16; Lifecycle Status: Active; Minimum Order: 1; Number of Terminations: 2; Operating Temperature: -55°C ~ 155°C; Package / Case: 0603 (1608 Metric); Packaging: TapeAndReel; PartId: 8965; Part Status: Active; Price: 0.01; Ratings: AEC-Q200; Resistance: 10 kOhms; Series: ERJ; Size / Dimension: 0.063" L x 0.031" W (1.60mm x 0.80mm); Supplier 1: DigiKey; Supplier Part Number 1: P10KBZCT-ND; Supplier Device Package: 0603; Tolerance: ±5%
R19 = ERJ-3EKF1101V: RES SMD 1.1K OHM 1% 1/10W 0603; Manufacturer: Panasonic Electronic Components; Power (Watts): 0.1W, 1/10W; Temperature Coefficient: ±100ppm/°C; Part Number: ERJ-3EKF1101V; Value: 1.1 kOhms; ComponentLink1Description: Datasheet; ComponentLink1URL: https://industrial.panasonic.com/cdbs/www-data/pdf/RDA0000/AOA0000C304.pdf; ComponentLink2Description: DigiKey Link; ComponentLink2URL: http://digikey.com/product-detail/en/panasonic-electronic-components/ERJ-3EKF1101V/P1.10KHCT-ND/198075; Composition: Thick Film; Device Package: 0603 (1608 Metric); Features: Automotive AEC-Q200; Height - Seated (Max): 0.022" (0.55mm); LastUpdated: 02/09/2020 01:09:43; Lifecycle Status: Active; Minimum Order: 1; Number of Terminations: 2; Operating Temperature: -55°C ~ 155°C; Package / Case: 0603 (1608 Metric); Packaging: TapeAndReel; PartId: 23085; Part Status: Active; Price: 0.01; Ratings: AEC-Q200; Resistance: 1.1 kOhms; Series: ERJ; Size / Dimension: 0.063" L x 0.031" W (1.60mm x 0.80mm); Supplier 1: DigiKey; Supplier Part Number 1: P1.10KHCT-ND; Supplier Device Package: 0603; Tolerance: ±1%
S4 = SK-12F17-G 7: SWITCH SLIDE SPDT 300MA 30V; Manufacturer: C&K; Actuator Length: 7.00mm; Actuator Type: Standard; Contact Timing: Not Specified; Current Rating (Amps): 300mA (DC); Switch Function: On-On; Part Number: SK-12F17-G 7; Circuit: SPDT; ComponentLink1Description: Datasheet; ComponentLink1URL: //media.digikey.com/pdf/Data%20Sheets/C&K/SK-12F17-G.pdf; ComponentLink2Description: DigiKey Link; ComponentLink2URL: http://digikey.com/product-detail/en/c-k/SK-12F17-G-7/CKN10393-ND/2747163; Contact Finish: Silver; Contact Material: Copper; LastUpdated: 22/01/2022 09:16:27; Lifecycle Status: Active; Minimum Order: 1; Mounting Type: Through Hole, Right Angle; Packaging: Bulk; PartId: 3; Part Status: Active; Price: 0.55; Series: SK, COMAX; Supplier 1: DigiKey; Supplier Part Number 1: CKN10393-ND; Termination Style: PC Pin; Voltage Rating - DC: 30V

## Sheet Voltage Regulation.SchDoc: Voltage Regulation
size A4; SheetNumber: 7; SheetTotal: 7
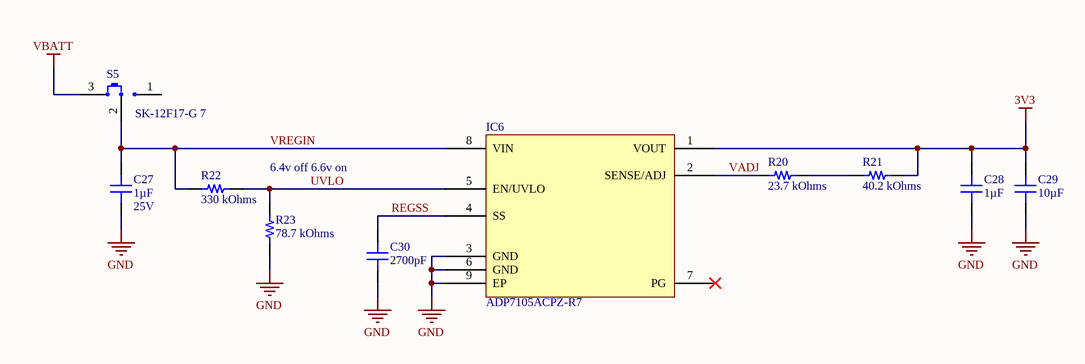
[diagram p3: Voltage Regulation.SchDoc]

### Parts
C27  Voltage - Rated: 25V  [CAP 0603_1608]  (hidden comment: 1µF)
C28  1µF  [CAP 0603_1608]
C29  10µF  [CAP 0805_2012]
C30  2700pF  [CAP 0603_1608]
IC6  ADP7105ACPZ-R7  [AD LFCSP-8 3x3MM CP-8-5]
R20  23.7 kOhms  [RES 0603_1608]
R21  40.2 kOhms  [RES 0603_1608]
R22  330 kOhms  [RES 0603_1608]
R23  78.7 kOhms  [RES 0603_1608]
S5  SK-12F17-G 7  [C&K SK-12F17-G 7]

### Nets
3V3: C28.2 C29.2 IC6.1(VOUT) R21.1
GND: C27.2 C28.1 C29.1 C30.1 IC6.3(GND) IC6.6(GND) IC6.9(EP) R23.1
VBATT: S5.3
REGSS: C30.2 IC6.4(SS)
UVLO: IC6.5(EN/UVLO) R22.2 R23.2
VADJ: IC6.2(SENSE/ADJ) R20.1
VREGIN: C27.1 IC6.8(VIN) R22.1 S5.2(COM)
NetR20_2: R20.2 R21.2

Not connected (* = marked no-connect by the designer): IC6 7(PG)*; S5 1

### Notes on the sheet
- 6.4v off 6.6v on
- Title
- Size:
- Date:
- A4
- Number:
- Time:
- Revision:
- Sheet
- of
- File:

### Library data of the parts
C27 = CL10A105KA8NNNC: as C25 on sheet Battery Charger; Part Number: CL10A105KA8NNNC; Value: 1µF; Applications: General Purpose; Capacitance: 1µF; ComponentLink1Description: Datasheet; ComponentLink1URL: http://www.samsungsem.com/kr/support/product-search/mlcc/CL10A105KA8NNNC.jsp; ComponentLink2Description: DigiKey Link; ComponentLink2URL: http://digikey.com/product-detail/en/samsung-electro-mechanics/CL10A105KA8NNNC/1276-1102-1-ND/3889188; Device Package: 0603 (1608 Metric); LastUpdated: 02/09/2020 01:03:30; Lifecycle Status: Active; Minimum Order: 1; Mounting Type: Surface Mount, MLCC; Operating Temperature: -55°C ~ 85°C; Package / Case: 0603 (1608 Metric); Packaging: TapeAndReel; PartId: 5508; Part Status: Active; Price: 0.01; Series: CL; Size / Dimension: 0.063" L x 0.031" W (1.60mm x 0.80mm); Supplier 1: DigiKey; Supplier Part Number 1: 1276-1102-1-ND; Temperature Coefficient: X5R; Thickness (Max): 0.035" (0.90mm)
C28 = LMK107B7105KA-T: as C18 on sheet Microcontroller; Part Number: LMK107B7105KA-T; Value: 1µF; Applications: General Purpose; Capacitance: 1µF; ComponentLink1Description: Datasheet; ComponentLink1URL: https://www.yuden.co.jp/productdata/catalog/mlcc01_e.pdf; ComponentLink2Description: DigiKey Link; ComponentLink2URL: http://digikey.com/product-detail/en/taiyo-yuden/LMK107B7105KA-T/587-1242-1-ND/931019; Device Package: 0603 (1608 Metric); LastUpdated: 02/09/2020 01:03:30; Lifecycle Status: Active; Minimum Order: 1; Mounting Type: Surface Mount, MLCC; Operating Temperature: -55°C ~ 125°C; Package / Case: 0603 (1608 Metric); Packaging: TapeAndReel; PartId: 5525; Part Status: Active; Price: 0.01; Series: M; Size / Dimension: 0.063" L x 0.031" W (1.60mm x 0.80mm); Supplier 1: DigiKey; Supplier Part Number 1: 587-1242-1-ND; Temperature Coefficient: X7R; Thickness (Max): 0.035" (0.90mm); Voltage - Rated: 10V
C29 = CL21A106KPCLQNC: as C13 on sheet Microcontroller; Part Number: CL21A106KPCLQNC; Value: 10µF; Applications: General Purpose; Capacitance: 10µF; ComponentLink1Description: Datasheet; ComponentLink1URL: http://www.samsungsem.com/kr/support/product-search/mlcc/CL21A106KPCLQNC.jsp; ComponentLink2Description: DigiKey Link; ComponentLink2URL: http://digikey.com/product-detail/en/samsung-electro-mechanics/CL21A106KPCLQNC/1276-2402-1-ND/3890488; Device Package: 0805 (2012 Metric); LastUpdated: 02/09/2020 01:04:19; Lifecycle Status: Active; Minimum Order: 1; Mounting Type: Surface Mount, MLCC; Operating Temperature: -55°C ~ 85°C; Package / Case: 0805 (2012 Metric); Packaging: TapeAndReel; PartId: 14319; Part Status: Active; Price: 0.03; Series: CL; Size / Dimension: 0.079" L x 0.049" W (2.00mm x 1.25mm); Supplier 1: DigiKey; Supplier Part Number 1: 1276-2402-1-ND; Temperature Coefficient: X5R; Thickness (Max): 0.037" (0.95mm); Voltage - Rated: 10V
C30 = CC0603KRX7R9BB272: CAP CER 2700PF 50V X7R 0603; Manufacturer: Yageo; Tolerance: ±10%; Part Number: CC0603KRX7R9BB272; Value: 2700pF; Applications: General Purpose; Capacitance: 2700pF; ComponentLink1Description: Datasheet; ComponentLink1URL: https://www.yageo.com/upload/media/product/productsearch/datasheet/mlcc/UPY-GPHC_X7R_6.3V-to-50V_18.pdf; ComponentLink2Description: DigiKey Link; ComponentLink2URL: http://digikey.com/product-detail/en/yageo/CC0603KRX7R9BB272/311-1809-1-ND/5195711; Device Package: 0603 (1608 Metric); LastUpdated: 02/09/2020 01:03:26; Lifecycle Status: Active; Minimum Order: 1; Mounting Type: Surface Mount, MLCC; Operating Temperature: -55°C ~ 125°C; Package / Case: 0603 (1608 Metric); Packaging: TapeAndReel; PartId: 7860; Part Status: Active; Price: 0.01; Series: CC; Size / Dimension: 0.063" L x 0.031" W (1.60mm x 0.80mm); Supplier 1: DigiKey; Supplier Part Number 1: 311-1809-1-ND; Temperature Coefficient: X7R; Thickness (Max): 0.035" (0.90mm); Voltage - Rated: 50V
IC6 = ADP7105ACPZ-R7: IC REG LIN POS ADJ 500MA 8LFCSP; Manufacturer: Analog Devices Inc.; Control Features: Enable, Power Good, Under Voltage Lockout; Current - Quiescent (Iq): 900µA; Current - Supply (Max): 1.6mA; Number of Regulators: 1; Output Configuration: Positive; Output Type: Adjustable; Protection Features: Over Current, Over Temperature, Reverse Polarity; PSRR: 80dB ~ 50dB (10kHz ~ 100kHz); Voltage Dropout (Max): 0.55V @ 500mA; Voltage - Input (Max): 20V; Voltage - Output (Max): 19V; Voltage - Output (Min/Fixed): 1.22V; Part Number: ADP7105ACPZ-R7; ComponentLink1Description: Datasheet; ComponentLink1URL: https://www.analog.com/media/en/technical-documentation/data-sheets/ADP7105.pdf; ComponentLink2Description: DigiKey Link; ComponentLink2URL: http://digikey.com/product-detail/en/analog-devices-inc/ADP7105ACPZ-R7/ADP7105ACPZ-R7CT-ND/4376403; Current - Output: 500mA; LastUpdated: 19/01/2022 13:38:13; Lifecycle Status: Active; Minimum Order: 1; Mounting Type: Surface Mount; Operating Temperature: -40°C ~ 125°C; Package / Case: 8-WFDFN Exposed Pad, CSP; Packaging: TapeAndReel; Part Status: Active; Price: 1.90; Series: -; Supplier 1: DigiKey; Supplier Part Number 1: ADP7105ACPZ-R7CT-ND; Supplier Device Package: 8-LFCSP-WD (3x3)
R20 = ERJ-3EKF2372V: RES SMD 23.7K OHM 1% 1/10W 0603; Manufacturer: Panasonic Electronic Components; Power (Watts): 0.1W, 1/10W; Temperature Coefficient: ±100ppm/°C; Part Number: ERJ-3EKF2372V; Value: 23.7 kOhms; ComponentLink1Description: Datasheet; ComponentLink1URL: https://industrial.panasonic.com/cdbs/www-data/pdf/RDA0000/AOA0000C304.pdf; ComponentLink2Description: DigiKey Link; ComponentLink2URL: http://digikey.com/product-detail/en/panasonic-electronic-components/ERJ-3EKF2372V/P23.7KHCT-ND/198263; Composition: Thick Film; Device Package: 0603 (1608 Metric); Features: Automotive AEC-Q200; Height - Seated (Max): 0.022" (0.55mm); LastUpdated: 02/09/2020 01:09:29; Lifecycle Status: Active; Minimum Order: 1; Number of Terminations: 2; Operating Temperature: -55°C ~ 155°C; Package / Case: 0603 (1608 Metric); Packaging: TapeAndReel; PartId: 26029; Part Status: Active; Price: 0.01; Ratings: AEC-Q200; Resistance: 23.7 kOhms; Series: ERJ; Size / Dimension: 0.063" L x 0.031" W (1.60mm x 0.80mm); Supplier 1: DigiKey; Supplier Part Number 1: P23.7KHCT-ND; Supplier Device Package: 0603; Tolerance: ±1%
R21 = ERJ-3EKF4022V: RES SMD 40.2K OHM 1% 1/10W 0603; Manufacturer: Panasonic Electronic Components; Power (Watts): 0.1W, 1/10W; Temperature Coefficient: ±100ppm/°C; Part Number: ERJ-3EKF4022V; Value: 40.2 kOhms; ComponentLink1Description: Datasheet; ComponentLink1URL: https://industrial.panasonic.com/cdbs/www-data/pdf/RDA0000/AOA0000C304.pdf; ComponentLink2Description: DigiKey Link; ComponentLink2URL: http://digikey.com/product-detail/en/panasonic-electronic-components/ERJ-3EKF4022V/P40.2KHCT-ND/198375; Composition: Thick Film; Device Package: 0603 (1608 Metric); Features: Automotive AEC-Q200; Height - Seated (Max): 0.022" (0.55mm); LastUpdated: 02/09/2020 01:09:43; Lifecycle Status: Active; Minimum Order: 1; Number of Terminations: 2; Operating Temperature: -55°C ~ 155°C; Package / Case: 0603 (1608 Metric); Packaging: TapeAndReel; PartId: 23106; Part Status: Active; Price: 0.01; Ratings: AEC-Q200; Resistance: 40.2 kOhms; Series: ERJ; Size / Dimension: 0.063" L x 0.031" W (1.60mm x 0.80mm); Supplier 1: DigiKey; Supplier Part Number 1: P40.2KHCT-ND; Supplier Device Package: 0603; Tolerance: ±1%
R22 = ERJ-PA3J334V: as R15 on sheet Battery Charger; Part Number: ERJ-PA3J334V; Value: 330 kOhms; ComponentLink1Description: Datasheet; ComponentLink1URL: https://industrial.panasonic.com/cdbs/www-data/pdf/RDO0000/AOA0000C331.pdf; ComponentLink2Description: DigiKey Link; ComponentLink2URL: http://digikey.com/product-detail/en/panasonic-electronic-components/ERJ-PA3J334V/P330KBZCT-ND/5036310; Composition: Thick Film; Device Package: 0603 (1608 Metric); Features: Automotive AEC-Q200, Pulse Withstanding; Height - Seated (Max): 0.022" (0.55mm); LastUpdated: 02/09/2020 01:10:16; Lifecycle Status: Active; Minimum Order: 1; Number of Terminations: 2; Operating Temperature: -55°C ~ 155°C; Package / Case: 0603 (1608 Metric); Packaging: TapeAndReel; PartId: 8919; Part Status: Active; Price: 0.01; Ratings: AEC-Q200; Resistance: 330 kOhms; Series: ERJ; Size / Dimension: 0.063" L x 0.031" W (1.60mm x 0.80mm); Supplier 1: DigiKey; Supplier Part Number 1: P330KBZCT-ND; Supplier Device Package: 0603; Tolerance: ±5%
R23 = ERJ-3EKF7872V: RES SMD 78.7K OHM 1% 1/10W 0603; Manufacturer: Panasonic Electronic Components; Power (Watts): 0.1W, 1/10W; Temperature Coefficient: ±100ppm/°C; Part Number: ERJ-3EKF7872V; Value: 78.7 kOhms; ComponentLink1Description: Datasheet; ComponentLink1URL: https://industrial.panasonic.com/cdbs/www-data/pdf/RDA0000/AOA0000C304.pdf; ComponentLink2Description: DigiKey Link; ComponentLink2URL: http://digikey.com/product-detail/en/panasonic-electronic-components/ERJ-3EKF7872V/P78.7KHCT-ND/198511; Composition: Thick Film; Device Package: 0603 (1608 Metric); Features: Automotive AEC-Q200; Height - Seated (Max): 0.022" (0.55mm); LastUpdated: 02/09/2020 01:09:29; Lifecycle Status: Active; Minimum Order: 1; Number of Terminations: 2; Operating Temperature: -55°C ~ 155°C; Package / Case: 0603 (1608 Metric); Packaging: TapeAndReel; PartId: 26003; Part Status: Active; Price: 0.01; Ratings: AEC-Q200; Resistance: 78.7 kOhms; Series: ERJ; Size / Dimension: 0.063" L x 0.031" W (1.60mm x 0.80mm); Supplier 1: DigiKey; Supplier Part Number 1: P78.7KHCT-ND; Supplier Device Package: 0603; Tolerance: ±1%
S5 = SK-12F17-G 7: as S4 on sheet Battery Charger; Part Number: SK-12F17-G 7; Circuit: SPDT; ComponentLink1Description: Datasheet; ComponentLink1URL: //media.digikey.com/pdf/Data%20Sheets/C&K/SK-12F17-G.pdf; ComponentLink2Description: DigiKey Link; ComponentLink2URL: http://digikey.com/product-detail/en/c-k/SK-12F17-G-7/CKN10393-ND/2747163; Contact Finish: Silver; Contact Material: Copper; LastUpdated: 22/01/2022 09:16:27; Lifecycle Status: Active; Minimum Order: 1; Mounting Type: Through Hole, Right Angle; Packaging: Bulk; PartId: 3; Part Status: Active; Price: 0.55; Series: SK, COMAX; Supplier 1: DigiKey; Supplier Part Number 1: CKN10393-ND; Termination Style: PC Pin; Voltage Rating - DC: 30V